# Altium schematic sheet DriveBoard_V2.SchDoc
size A4
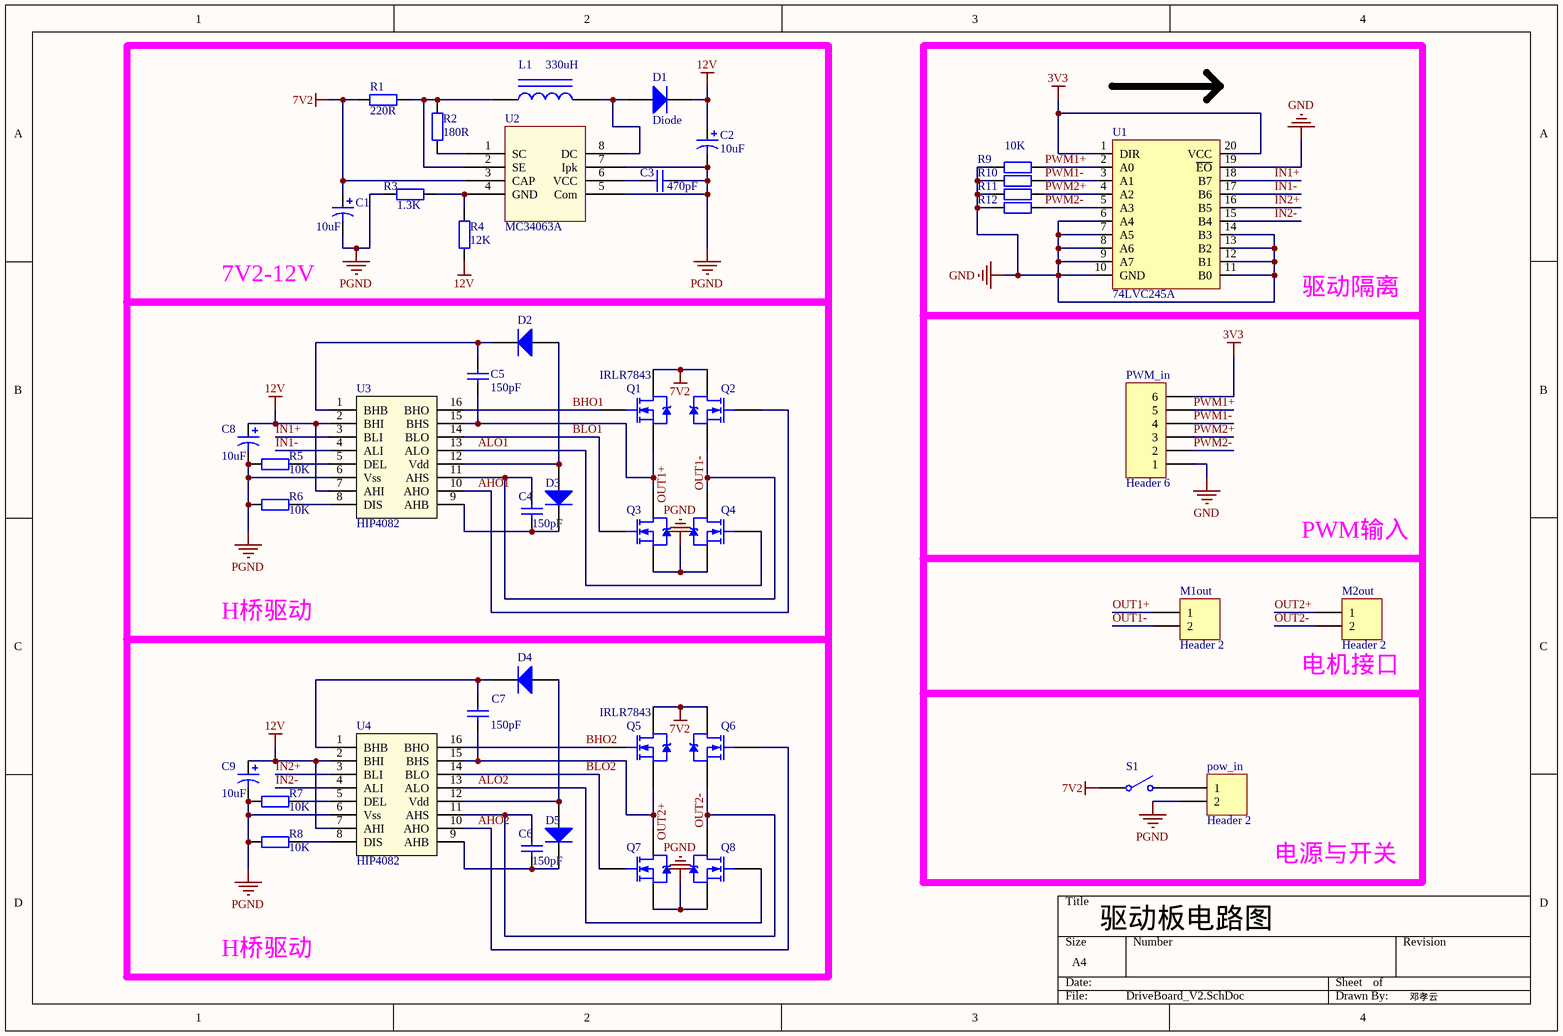
[diagram p0: DriveBoard_V2.SchDoc]

## Parts
C1  value 10uF  [1206 C tan]  (hidden comment: Cap Pol1)
C2  value 10uF  [1206 C tan]  (hidden comment: Cap Pol1)
C3  value 470pF  [0603 C]  (hidden comment: Cap)
C4  value 150pF  [0603 C]  (hidden comment: Cap)
C5  value 150pF  [0603 C]  (hidden comment: Cap)
C6  value 150pF  [0603 C]  (hidden comment: Cap)
C7  value 150pF  [0603 C]  (hidden comment: Cap)
C8  value 10uF  [1206 C tan]  (hidden comment: Cap Pol1)
C9  value 10uF  [1206 C tan]  (hidden comment: Cap Pol1)
D1  Diode  [1206 D]
D2  Diode  [SOD-123]  (value not drawn)
D3  Diode  [SOD-123]  (value not drawn)
D4  Diode  [SOD-123]  (value not drawn)
D5  Diode  [SOD-123]  (value not drawn)
L1  value 330uH  [CDRH74R]  (hidden comment: Inductor Iron)
M1out  Header 2  [Connect 050-2]
M2out  Header 2  [Connect 050-2]
pow_in  Header 2  [Connect 050-2]
PWM_in  Header 6  [Header P6]
Q1  IRLR7843  [LR7843]
Q2  IRLR7843  [LR7843]  (value not drawn)
Q3  IRLR7843  [LR7843]  (value not drawn)
Q4  IRLR7843  [LR7843]  (value not drawn)
Q5  IRLR7843  [LR7843]
Q6  IRLR7843  [LR7843]  (value not drawn)
Q7  IRLR7843  [LR7843]  (value not drawn)
Q8  IRLR7843  [LR7843]  (value not drawn)
R1  value 220R  [0805 R]  (hidden comment: Res2)
R2  value 180R  [0603 R]  (hidden comment: Res2)
R3  value 1.3K  [0603 R]  (hidden comment: Res2)
R4  value 12K  [0805 R]  (hidden comment: Res2)
R5  value 10K  [0805 R]  (hidden comment: Res2)
R6  value 10K  [0805 R]  (hidden comment: Res2)
R7  value 10K  [0805 R]  (hidden comment: Res2)
R8  value 10K  [0805 R]  (hidden comment: Res2)
R9  value 10K  [0805 R]  (hidden comment: Res2)
R10  Res2  [0805 R]  (value not drawn)
R11  Res2  [0805 R]  (value not drawn)
R12  Res2  [0805 R]  (value not drawn)
S1  SW-SPST  [Switch]  (value not drawn)
U1  74LVC245A  [SOT163-1]
U2  MC34063A  [MC34063]
U3  HIP4082  [HIP4082]
U4  HIP4082  [HIP4082]

## Blocks framed on the sheet
7V2-12V: C1-C3 D1 L1 R1-R4 U2
驱动隔离: R9-R12 U1
H桥驱动: C4 C5 C8 D2 D3 Q1-Q4 R5 R6 U3
H桥驱动: C6 C7 C9 D4 D5 Q5-Q8 R7 R8 U4

## Nets
3V3: PWM_in.6 U1.1(DIR) U1.20(VCC)
7V2: C1.1 Q1.2(D) Q2.2(D) Q5.2(D) Q6.2(D) R1.1 S1.1(COMMON) U2.3(CAP)
12V: C2.1 C8.1 C9.1 D1.2(K) R4.1 U3.2(BHI) U3.7(AHI) U4.2(BHI) U4.7(AHI)
GND: PWM_in.1 R9.2 R10.2 R11.2 R12.2 U1.6(A4) U1.7(A5) U1.8(A6) U1.9(A7) U1.10(GND) U1.11(B0) U1.12(B1) U1.13(B2) U1.14(B3) U1.19(~{EO})
PGND: C1.2 C2.2 C3.1 C8.2 C9.2 pow_in.2 Q3.3(S) Q4.3(S) Q7.3(S) Q8.3(S) R3.2 R5.2 R6.2 R7.2 R8.2 U2.5(Com) U2.7(Ipk) U3.6(Vss) U4.6(Vss)
AHO1: Q2.1(G) U3.10(AHO)
AHO2: Q6.1(G) U4.10(AHO)
ALO1: Q4.1(G) U3.13(ALO)
ALO2: Q8.1(G) U4.13(ALO)
BHO1: Q1.1(G) U3.16(BHO)
BHO2: Q5.1(G) U4.16(BHO)
BLO1: Q3.1(G) U3.14(BLO)
BLO2: Q7.1(G) U4.14(BLO)
IN1+: U1.18(B7) U3.3(BLI)
IN1-: U1.17(B6) U3.4(ALI)
IN2+: U1.16(B5) U4.3(BLI)
IN2-: U1.15(B4) U4.4(ALI)
OUT1+: C5.1 M1out.1 Q1.3(S) Q3.2(D) U3.15(BHS)
OUT1-: C4.2 M1out.2 Q2.3(S) Q4.2(D) U3.11(AHS)
OUT2+: C7.1 M2out.1 Q5.3(S) Q7.2(D) U4.15(BHS)
OUT2-: C6.2 M2out.2 Q6.3(S) Q8.2(D) U4.11(AHS)
PWM1+: PWM_in.5 R9.1 U1.2(A0)
PWM1-: PWM_in.4 R10.1 U1.3(A1)
PWM2+: PWM_in.3 R11.1 U1.4(A2)
PWM2-: PWM_in.2 R12.1 U1.5(A3)
NetC3_2: C3.2 U2.6(VCC)
NetC4_1: C4.1 D3.2(K) U3.9(AHB)
NetC5_2: C5.2 D2.2(K) U3.1(BHB)
NetC6_1: C6.1 D5.2(K) U4.9(AHB)
NetC7_2: C7.2 D4.2(K) U4.1(BHB)
NetD1_1: D1.1(A) L1.2 U2.8(DC)
NetD2_1: D2.1(A) D3.1(A) U3.12(Vdd)
NetD4_1: D4.1(A) D5.1(A) U4.12(Vdd)
NetL1_1: L1.1 R1.2 R2.2 U2.2(SE)
Netpow_in_1: pow_in.1 S1.2(NO)
NetR2_1: R2.1 U2.1(SC)
NetR3_1: R3.1 R4.2 U2.4(GND)
NetR5_1: R5.1 U3.5(DEL)
NetR6_1: R6.1 U3.8(DIS)
NetR7_1: R7.1 U4.5(DEL)
NetR8_1: R8.1 U4.8(DIS)

## Notes on the sheet
- PWM输入
- (near M2out) 电机接口
- 电源与开关
- 驱动板电路图
- 邓孝云

## Library data of the parts
C1 C2 C8 C9 = Cap Pol1: Polarized Capacitor (Radial); Published: 8-Jun-2000; LatestRevisionDate: 17-Jul-2002; LatestRevisionNote: Re-released for DXP Platform.; PackageReference: RB7.6-15; Publisher: Altium Limited; PackageDescription: Polarized Capacitor (Radial); 2 Leads
C3-C7 = Cap: Capacitor; Published: 8-Jun-2000; LatestRevisionDate: 17-Jul-2002; LatestRevisionNote: Re-released for DXP Platform.; PackageReference: RAD-0.3; Publisher: Altium Limited; PackageDescription: Radial Cap, Thru-Hole; 2 Leads; 0.3 in Pin Spacing
D1-D5 = Diode: Default Diode; Published: 8-Jun-2000; LatestRevisionDate: 17-Jul-2002; LatestRevisionNote: Re-released for DXP Platform.; PackageVersion: Sep-1996; PackageReference: SMC; Publisher: Altium Limited; PackageDescription: DO-214-AB/SMC; 2 C-Bend Leads; Body 7.9 x 5.9 mm, inc. leads (LxW); Code_JEDEC: DO-214-AB
L1 = Inductor Iron: Magnetic-Core Inductor; Published: 24-Mar-1999; LatestRevisionDate: 17-Jul-2002; LatestRevisionNote: Re-released for DXP Platform.; PackageReference: AXIAL-0.9; Publisher: Altium Limited; PackageDescription: Axial Device, Thru-Hole; 2 Leads; 0.9 in Pin Spacing
M1out M2out pow_in = Header 2: Header, 2-Pin; LatestRevisionDate: 17-Jul-2002; LatestRevisionNote: Re-released for DXP Platform.; Publisher: Altium Limited
PWM_in = Header 6: Header, 6-Pin; LatestRevisionDate: 17-Jul-2002; LatestRevisionNote: Re-released for DXP Platform.; Publisher: Altium Limited
Q1-Q8 = NMOS-2: N-Channel Power MOSFET; Note: Pin 2 is electrically connected to pin 4.; Published: 8-Jun-2000; LatestRevisionDate: 17-Jul-2002; LatestRevisionNote: Re-released for DXP Platform.; DatasheetVersion: PD-9.814; PackageVersion: Feb-1997; PackageReference: TO-220AB; Publisher: Altium Limited; PackageDescription: TO, Thru-Hole, Vertical, Heatsink Mounted; 3 In-Line Leads; Pitch 2.54 mm; ComponentLink1Description: Manufacturer Link; ComponentLink1URL: http://www.irf.com/
R1-R9 = Res2: Resistor; Published: 8-Jun-2000; LatestRevisionDate: 17-Jul-2002; LatestRevisionNote: Re-released for DXP Platform.; PackageReference: AXIAL-0.4; Publisher: Altium Limited; PackageDescription: Axial Device, Thru-Hole; 2 Leads; 0.4 in Pin Spacing
R10-R12 = Res2: Resistor; Value: 10K; Published: 8-Jun-2000; LatestRevisionDate: 17-Jul-2002; LatestRevisionNote: Re-released for DXP Platform.; PackageReference: AXIAL-0.4; Publisher: Altium Limited; PackageDescription: Axial Device, Thru-Hole; 2 Leads; 0.4 in Pin Spacing
S1 = SW-SPST: Single-Pole, Single-Throw Switch; Published: 24-Mar-1999; LatestRevisionDate: 17-Jul-2002; LatestRevisionNote: Re-released for DXP Platform.; PackageReference: SPST-2; Publisher: Altium Limited; PackageDescription: Switch; 2 Leads